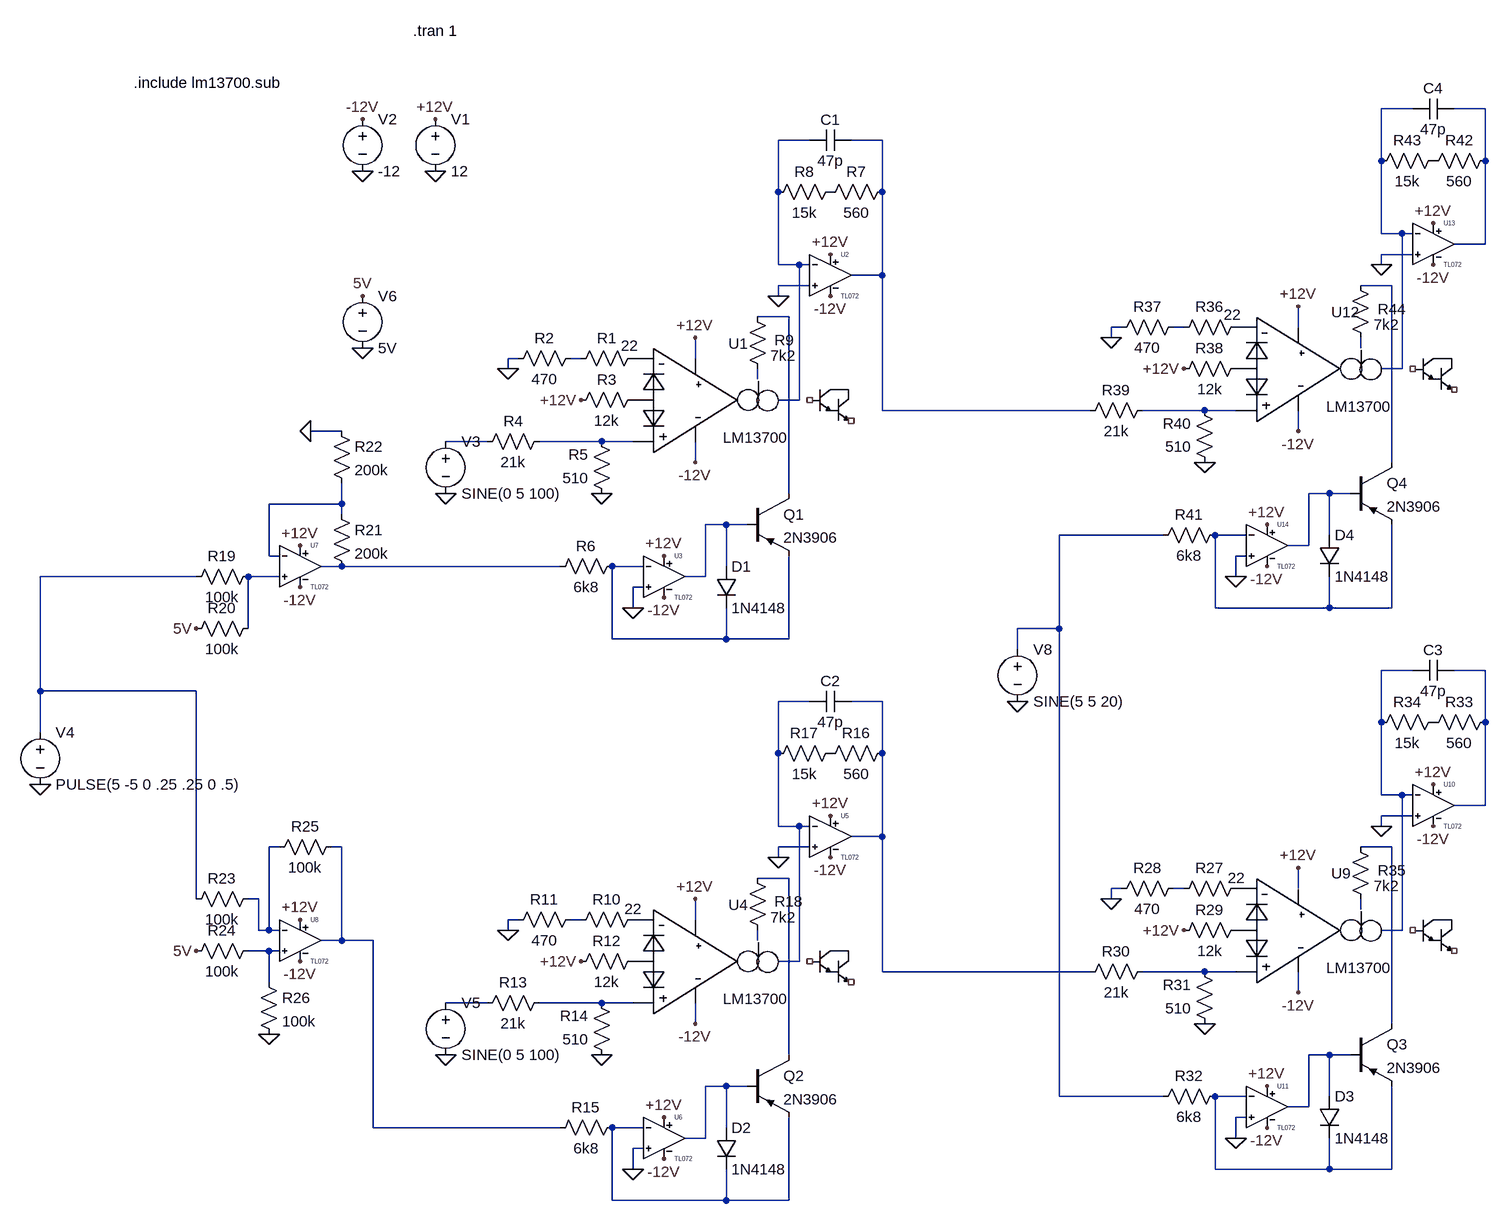
[diagram p0: schematic panner.asc]
panner.asc, the LTspice schematic file:
Version 4
SHEET 1 1512 1252
WIRE 1392 -464 1344 -464
WIRE 1504 -464 1456 -464
WIRE 464 -416 416 -416
WIRE 576 -416 528 -416
WIRE 1344 -384 1344 -464
WIRE 1504 -384 1504 -464
WIRE 416 -336 416 -416
WIRE 576 -336 576 -416
WIRE 1344 -272 1344 -384
WIRE 1376 -272 1344 -272
WIRE 1392 -272 1376 -272
WIRE 1504 -256 1504 -384
WIRE 1504 -256 1456 -256
WIRE 1392 -240 1344 -240
WIRE 416 -224 416 -336
WIRE 448 -224 416 -224
WIRE 464 -224 448 -224
WIRE 1344 -224 1344 -240
WIRE 576 -208 576 -336
WIRE 576 -208 528 -208
WIRE 464 -192 416 -192
WIRE 1360 -192 1312 -192
WIRE 416 -176 416 -192
WIRE 432 -144 384 -144
WIRE 944 -128 928 -128
WIRE 1040 -128 1024 -128
WIRE 1216 -128 1216 -160
WIRE 928 -112 928 -128
WIRE 1312 -96 1312 -112
WIRE 16 -80 0 -80
WIRE 112 -80 96 -80
WIRE 288 -80 288 -112
WIRE 0 -64 0 -80
WIRE 1376 -64 1376 -272
WIRE 1376 -64 1344 -64
WIRE 384 -48 384 -64
WIRE 448 -16 448 -224
WIRE 448 -16 416 -16
WIRE 576 0 576 -208
WIRE 896 0 576 0
WIRE 1072 0 976 0
WIRE 1120 0 1072 0
WIRE -256 32 -304 32
WIRE 1216 32 1216 0
WIRE -32 48 -96 48
WIRE 144 48 48 48
WIRE 192 48 144 48
WIRE 288 80 288 48
WIRE 1360 80 1360 -192
WIRE 432 128 432 -144
WIRE 1264 128 1232 128
WIRE 1296 128 1264 128
WIRE -256 144 -256 112
WIRE -256 144 -368 144
WIRE -256 160 -256 144
WIRE 336 176 304 176
WIRE 368 176 336 176
WIRE 1008 192 848 192
WIRE 1136 192 1088 192
WIRE 1264 192 1264 128
WIRE 1232 208 1232 128
WIRE 1232 208 1200 208
WIRE -368 224 -368 144
WIRE -352 224 -368 224
WIRE 1136 224 1120 224
WIRE -256 240 -288 240
WIRE 80 240 -256 240
WIRE 208 240 160 240
WIRE 336 240 336 176
WIRE -480 256 -720 256
WIRE -352 256 -400 256
WIRE 304 256 304 176
WIRE 304 256 272 256
WIRE 1120 256 1120 224
WIRE 208 272 192 272
WIRE 192 304 192 272
WIRE 1088 304 1088 192
WIRE 1264 304 1264 256
WIRE 1264 304 1088 304
WIRE 1360 304 1360 176
WIRE 1360 304 1264 304
WIRE -400 336 -400 256
WIRE 848 336 848 192
WIRE 848 336 784 336
WIRE 160 352 160 240
WIRE 336 352 336 304
WIRE 336 352 160 352
WIRE 432 352 432 224
WIRE 432 352 336 352
WIRE 784 368 784 336
WIRE 1392 400 1344 400
WIRE 1504 400 1456 400
WIRE -720 432 -720 256
WIRE -480 432 -720 432
WIRE 464 448 416 448
WIRE 576 448 528 448
WIRE 1344 480 1344 400
WIRE 1504 480 1504 400
WIRE -720 496 -720 432
WIRE 416 528 416 448
WIRE 576 528 576 448
WIRE 1344 592 1344 480
WIRE 1376 592 1344 592
WIRE 1392 592 1376 592
WIRE 1504 608 1504 480
WIRE 1504 608 1456 608
WIRE 1392 624 1344 624
WIRE 416 640 416 528
WIRE 448 640 416 640
WIRE 464 640 448 640
WIRE 1344 640 1344 624
WIRE 576 656 576 528
WIRE 576 656 528 656
WIRE -352 672 -368 672
WIRE -256 672 -272 672
WIRE 464 672 416 672
WIRE 1360 672 1312 672
WIRE 416 688 416 672
WIRE 432 720 384 720
WIRE 944 736 928 736
WIRE 1040 736 1024 736
WIRE 1216 736 1216 704
WIRE -480 752 -480 432
WIRE -384 752 -400 752
WIRE 928 752 928 736
WIRE 1312 768 1312 752
WIRE 16 784 0 784
WIRE 112 784 96 784
WIRE 288 784 288 752
WIRE -384 800 -384 752
WIRE -368 800 -368 672
WIRE -368 800 -384 800
WIRE -352 800 -368 800
WIRE 0 800 0 784
WIRE 1376 800 1376 592
WIRE 1376 800 1344 800
WIRE -256 816 -256 672
WIRE -256 816 -288 816
WIRE -208 816 -256 816
WIRE 384 816 384 800
WIRE -368 832 -400 832
WIRE -352 832 -368 832
WIRE 448 848 448 640
WIRE 448 848 416 848
WIRE 576 864 576 656
WIRE 896 864 576 864
WIRE 1072 864 976 864
WIRE 1120 864 1072 864
WIRE -368 880 -368 832
WIRE 1216 896 1216 864
WIRE -32 912 -96 912
WIRE 144 912 48 912
WIRE 192 912 144 912
WIRE 288 944 288 912
WIRE 1360 944 1360 672
WIRE 432 992 432 720
WIRE 1264 992 1232 992
WIRE 1296 992 1264 992
WIRE 336 1040 304 1040
WIRE 368 1040 336 1040
WIRE 848 1056 848 336
WIRE 1008 1056 848 1056
WIRE 1136 1056 1088 1056
WIRE 1264 1056 1264 992
WIRE 1232 1072 1232 992
WIRE 1232 1072 1200 1072
WIRE 1136 1088 1120 1088
WIRE -208 1104 -208 816
WIRE 80 1104 -208 1104
WIRE 208 1104 160 1104
WIRE 336 1104 336 1040
WIRE 304 1120 304 1040
WIRE 304 1120 272 1120
WIRE 1120 1120 1120 1088
WIRE 208 1136 192 1136
WIRE 192 1168 192 1136
WIRE 1088 1168 1088 1056
WIRE 1264 1168 1264 1120
WIRE 1264 1168 1088 1168
WIRE 1360 1168 1360 1040
WIRE 1360 1168 1264 1168
WIRE 160 1216 160 1104
WIRE 336 1216 336 1168
WIRE 336 1216 160 1216
WIRE 432 1216 432 1088
WIRE 432 1216 336 1216
FLAG -112 -368 0
FLAG -112 -448 +12V
FLAG -224 -448 -12V
FLAG -224 -368 0
FLAG 0 800 0
FLAG 112 848 +12V
FLAG 288 752 +12V
FLAG 496 624 +12V
FLAG 240 1088 +12V
FLAG 288 944 -12V
FLAG 496 688 -12V
FLAG 240 1152 -12V
FLAG -96 992 0
FLAG 144 992 0
FLAG 192 1168 0
FLAG 416 688 0
FLAG 0 -64 0
FLAG 112 -16 +12V
FLAG 288 -112 +12V
FLAG 496 -240 +12V
FLAG 240 224 +12V
FLAG 288 80 -12V
FLAG 496 -176 -12V
FLAG 240 288 -12V
FLAG -96 128 0
FLAG 144 128 0
FLAG 192 304 0
FLAG -720 576 0
FLAG 416 -176 0
FLAG -320 208 +12V
FLAG -320 272 -12V
FLAG -304 32 0
FLAG -224 -96 0
FLAG -224 -176 5V
FLAG -480 336 5V
FLAG -320 784 +12V
FLAG -320 848 -12V
FLAG -368 960 0
FLAG -480 832 5V
FLAG 928 752 0
FLAG 1040 800 +12V
FLAG 1216 704 +12V
FLAG 1424 576 +12V
FLAG 1168 1040 +12V
FLAG 1216 896 -12V
FLAG 1424 640 -12V
FLAG 1168 1104 -12V
FLAG 1072 944 0
FLAG 1120 1120 0
FLAG 1344 640 0
FLAG 928 -112 0
FLAG 1040 -64 +12V
FLAG 1216 -160 +12V
FLAG 1424 -288 +12V
FLAG 1168 176 +12V
FLAG 1216 32 -12V
FLAG 1424 -224 -12V
FLAG 1168 240 -12V
FLAG 1072 80 0
FLAG 1120 256 0
FLAG 1344 -224 0
FLAG 784 448 0
SYMBOL voltage -112 -464 R0
WINDOW 123 0 0 Left 0
WINDOW 39 0 0 Left 0
SYMATTR InstName V1
SYMATTR Value 12
SYMBOL voltage -224 -464 R0
WINDOW 123 0 0 Left 0
WINDOW 39 0 0 Left 0
SYMATTR InstName V2
SYMATTR Value -12
SYMBOL LM13700 256 768 R0
SYMATTR InstName U4
SYMBOL res 208 768 R90
WINDOW 0 0 56 VBottom 2
WINDOW 3 -16 15 VTop 2
SYMATTR InstName R10
SYMATTR Value 22
SYMBOL res 112 768 R90
WINDOW 0 0 56 VBottom 2
WINDOW 3 32 56 VTop 2
SYMATTR InstName R11
SYMATTR Value 470
SYMBOL res 208 832 R90
WINDOW 0 0 56 VBottom 2
WINDOW 3 32 56 VTop 2
SYMATTR InstName R12
SYMATTR Value 12k
SYMBOL voltage -96 896 R0
WINDOW 123 0 0 Left 0
WINDOW 39 0 0 Left 0
SYMATTR InstName V5
SYMATTR Value SINE(0 5 100)
SYMBOL res 64 896 R90
WINDOW 0 0 56 VBottom 2
WINDOW 3 32 56 VTop 2
SYMATTR InstName R13
SYMATTR Value 21k
SYMBOL res 160 1008 R180
WINDOW 0 36 76 Left 2
WINDOW 3 36 40 Left 2
SYMATTR InstName R14
SYMATTR Value 510
SYMBOL TL072 496 592 R0
SYMATTR InstName U5
SYMBOL TL072 240 1056 R0
SYMATTR InstName U6
SYMBOL res 176 1088 R90
WINDOW 0 0 56 VBottom 2
WINDOW 3 32 56 VTop 2
SYMATTR InstName R15
SYMATTR Value 6k8
SYMBOL res 592 512 R90
WINDOW 0 0 56 VBottom 2
WINDOW 3 32 56 VTop 2
SYMATTR InstName R16
SYMATTR Value 560
SYMBOL res 512 512 R90
WINDOW 0 0 56 VBottom 2
WINDOW 3 32 56 VTop 2
SYMATTR InstName R17
SYMATTR Value 15k
SYMBOL res 368 704 R0
WINDOW 0 42 52 Left 2
SYMATTR InstName R18
SYMATTR Value 7k2
SYMBOL pnp 368 992 R0
SYMATTR InstName Q2
SYMATTR Value 2N3906
SYMBOL diode 320 1104 R0
SYMATTR InstName D2
SYMATTR Value 1N4148
SYMBOL cap 528 432 R90
WINDOW 0 0 32 VBottom 2
WINDOW 3 32 32 VTop 2
SYMATTR InstName C2
SYMATTR Value 47p
SYMBOL LM13700 256 -96 R0
SYMATTR InstName U1
SYMBOL res 208 -96 R90
WINDOW 0 0 56 VBottom 2
WINDOW 3 -19 21 VTop 2
SYMATTR InstName R1
SYMATTR Value 22
SYMBOL res 112 -96 R90
WINDOW 0 0 56 VBottom 2
WINDOW 3 32 56 VTop 2
SYMATTR InstName R2
SYMATTR Value 470
SYMBOL res 208 -32 R90
WINDOW 0 0 56 VBottom 2
WINDOW 3 32 56 VTop 2
SYMATTR InstName R3
SYMATTR Value 12k
SYMBOL voltage -96 32 R0
WINDOW 123 0 0 Left 0
WINDOW 39 0 0 Left 0
SYMATTR InstName V3
SYMATTR Value SINE(0 5 100)
SYMBOL res 64 32 R90
WINDOW 0 0 56 VBottom 2
WINDOW 3 32 56 VTop 2
SYMATTR InstName R4
SYMATTR Value 21k
SYMBOL res 160 144 R180
WINDOW 0 36 76 Left 2
WINDOW 3 36 40 Left 2
SYMATTR InstName R5
SYMATTR Value 510
SYMBOL TL072 496 -272 R0
SYMATTR InstName U2
SYMBOL TL072 240 192 R0
SYMATTR InstName U3
SYMBOL res 176 224 R90
WINDOW 0 0 56 VBottom 2
WINDOW 3 32 56 VTop 2
SYMATTR InstName R6
SYMATTR Value 6k8
SYMBOL res 592 -352 R90
WINDOW 0 0 56 VBottom 2
WINDOW 3 32 56 VTop 2
SYMATTR InstName R7
SYMATTR Value 560
SYMBOL res 512 -352 R90
WINDOW 0 0 56 VBottom 2
WINDOW 3 32 56 VTop 2
SYMATTR InstName R8
SYMATTR Value 15k
SYMBOL res 368 -160 R0
WINDOW 0 42 52 Left 2
SYMATTR InstName R9
SYMATTR Value 7k2
SYMBOL pnp 368 128 R0
SYMATTR InstName Q1
SYMATTR Value 2N3906
SYMBOL diode 320 240 R0
SYMATTR InstName D1
SYMATTR Value 1N4148
SYMBOL voltage -720 480 R0
WINDOW 123 0 0 Left 0
WINDOW 39 0 0 Left 0
SYMATTR InstName V4
SYMATTR Value PULSE(5 -5 0 .25 .25 0 .5)
SYMBOL cap 528 -432 R90
WINDOW 0 0 32 VBottom 2
WINDOW 3 32 32 VTop 2
SYMATTR InstName C1
SYMATTR Value 47p
SYMBOL TL072 -320 176 R0
SYMATTR InstName U7
SYMBOL res -384 240 R90
WINDOW 0 0 56 VBottom 2
WINDOW 3 32 56 VTop 2
SYMATTR InstName R19
SYMATTR Value 100k
SYMBOL res -384 320 R90
WINDOW 0 0 56 VBottom 2
WINDOW 3 32 56 VTop 2
SYMATTR InstName R20
SYMATTR Value 100k
SYMBOL res -272 144 R0
SYMATTR InstName R21
SYMATTR Value 200k
SYMBOL res -272 16 R0
SYMATTR InstName R22
SYMATTR Value 200k
SYMBOL voltage -224 -192 R0
WINDOW 123 0 0 Left 0
WINDOW 39 0 0 Left 0
SYMATTR InstName V6
SYMATTR Value 5V
SYMBOL TL072 -320 752 R0
SYMATTR InstName U8
SYMBOL res -384 736 R90
WINDOW 0 0 56 VBottom 2
WINDOW 3 32 56 VTop 2
SYMATTR InstName R23
SYMATTR Value 100k
SYMBOL res -384 816 R90
WINDOW 0 0 56 VBottom 2
WINDOW 3 32 56 VTop 2
SYMATTR InstName R24
SYMATTR Value 100k
SYMBOL res -256 656 R90
WINDOW 0 0 56 VBottom 2
WINDOW 3 32 56 VTop 2
SYMATTR InstName R25
SYMATTR Value 100k
SYMBOL res -384 864 R0
SYMATTR InstName R26
SYMATTR Value 100k
SYMBOL LM13700 1184 720 R0
SYMATTR InstName U9
SYMBOL res 1136 720 R90
WINDOW 0 0 56 VBottom 2
WINDOW 3 -16 15 VTop 2
SYMATTR InstName R27
SYMATTR Value 22
SYMBOL res 1040 720 R90
WINDOW 0 0 56 VBottom 2
WINDOW 3 32 56 VTop 2
SYMATTR InstName R28
SYMATTR Value 470
SYMBOL res 1136 784 R90
WINDOW 0 0 56 VBottom 2
WINDOW 3 32 56 VTop 2
SYMATTR InstName R29
SYMATTR Value 12k
SYMBOL res 992 848 R90
WINDOW 0 0 56 VBottom 2
WINDOW 3 32 56 VTop 2
SYMATTR InstName R30
SYMATTR Value 21k
SYMBOL res 1088 960 R180
WINDOW 0 36 76 Left 2
WINDOW 3 36 40 Left 2
SYMATTR InstName R31
SYMATTR Value 510
SYMBOL TL072 1424 544 R0
SYMATTR InstName U10
SYMBOL TL072 1168 1008 R0
SYMATTR InstName U11
SYMBOL res 1104 1040 R90
WINDOW 0 0 56 VBottom 2
WINDOW 3 32 56 VTop 2
SYMATTR InstName R32
SYMATTR Value 6k8
SYMBOL res 1520 464 R90
WINDOW 0 0 56 VBottom 2
WINDOW 3 32 56 VTop 2
SYMATTR InstName R33
SYMATTR Value 560
SYMBOL res 1440 464 R90
WINDOW 0 0 56 VBottom 2
WINDOW 3 32 56 VTop 2
SYMATTR InstName R34
SYMATTR Value 15k
SYMBOL res 1296 656 R0
WINDOW 0 42 52 Left 2
SYMATTR InstName R35
SYMATTR Value 7k2
SYMBOL pnp 1296 944 R0
SYMATTR InstName Q3
SYMATTR Value 2N3906
SYMBOL diode 1248 1056 R0
SYMATTR InstName D3
SYMATTR Value 1N4148
SYMBOL cap 1456 384 R90
WINDOW 0 0 32 VBottom 2
WINDOW 3 32 32 VTop 2
SYMATTR InstName C3
SYMATTR Value 47p
SYMBOL LM13700 1184 -144 R0
SYMATTR InstName U12
SYMBOL res 1136 -144 R90
WINDOW 0 0 56 VBottom 2
WINDOW 3 -19 21 VTop 2
SYMATTR InstName R36
SYMATTR Value 22
SYMBOL res 1040 -144 R90
WINDOW 0 0 56 VBottom 2
WINDOW 3 32 56 VTop 2
SYMATTR InstName R37
SYMATTR Value 470
SYMBOL res 1136 -80 R90
WINDOW 0 0 56 VBottom 2
WINDOW 3 32 56 VTop 2
SYMATTR InstName R38
SYMATTR Value 12k
SYMBOL res 992 -16 R90
WINDOW 0 0 56 VBottom 2
WINDOW 3 32 56 VTop 2
SYMATTR InstName R39
SYMATTR Value 21k
SYMBOL res 1088 96 R180
WINDOW 0 36 76 Left 2
WINDOW 3 36 40 Left 2
SYMATTR InstName R40
SYMATTR Value 510
SYMBOL TL072 1424 -320 R0
SYMATTR InstName U13
SYMBOL TL072 1168 144 R0
SYMATTR InstName U14
SYMBOL res 1104 176 R90
WINDOW 0 0 56 VBottom 2
WINDOW 3 32 56 VTop 2
SYMATTR InstName R41
SYMATTR Value 6k8
SYMBOL res 1520 -400 R90
WINDOW 0 0 56 VBottom 2
WINDOW 3 32 56 VTop 2
SYMATTR InstName R42
SYMATTR Value 560
SYMBOL res 1440 -400 R90
WINDOW 0 0 56 VBottom 2
WINDOW 3 32 56 VTop 2
SYMATTR InstName R43
SYMATTR Value 15k
SYMBOL res 1296 -208 R0
WINDOW 0 42 52 Left 2
SYMATTR InstName R44
SYMATTR Value 7k2
SYMBOL pnp 1296 80 R0
SYMATTR InstName Q4
SYMATTR Value 2N3906
SYMBOL diode 1248 192 R0
SYMATTR InstName D4
SYMATTR Value 1N4148
SYMBOL cap 1456 -480 R90
WINDOW 0 0 32 VBottom 2
WINDOW 3 32 32 VTop 2
SYMATTR InstName C4
SYMATTR Value 47p
SYMBOL voltage 784 352 R0
WINDOW 123 0 0 Left 0
WINDOW 39 0 0 Left 0
SYMATTR InstName V8
SYMATTR Value SINE(5 5 20)
TEXT -146 -584 Left 2 !.tran 1
TEXT -576 -504 Left 2 !.include lm13700.sub

The netlist it stands for:
* panner.asc
V1 +12V 0 12
V2 -12V 0 -12
XU4 P001 N038 P002 N034 N025 +12V -12V NC_01 NC_02 LM13700 HALF13700  ; pins LIN INP INN IAB ? VCC VSS BIN BUF
R10 P002 N033 22
R11 N033 0 470
R12 P001 +12V 12k
V5 N037 0 SINE(0 5 100)
R13 N038 N037 21k
R14 0 N038 510
XU5 0 N025 +12V -12V N026 TL072  ; pins In+ In- V+ V- OUT
XU6 0 N042 +12V -12V N040 TL072  ; pins In+ In- V+ V- OUT
R15 N042 N028 6k8
R16 N026 P003 560
R17 P003 N025 15k
R18 N030 N034 7k2
Q2 N030 N040 N042 0 2N3906
D2 N040 N042 1N4148
C2 N026 N025 47p
XU1 P004 N013 P005 N010 N003 +12V -12V NC_03 NC_04 LM13700 HALF13700  ; pins LIN INP INN IAB ? VCC VSS BIN BUF
R1 P005 N009 22
R2 N009 0 470
R3 P004 +12V 12k
V3 N012 0 SINE(0 5 100)
R4 N013 N012 21k
R5 0 N013 510
XU2 0 N003 +12V -12V N004 TL072  ; pins In+ In- V+ V- OUT
XU3 0 N020 +12V -12V N016 TL072  ; pins In+ In- V+ V- OUT
R6 N020 N019 6k8
R7 N004 P006 560
R8 P006 N003 15k
R9 N006 N010 7k2
Q1 N006 N016 N020 0 2N3906
D1 N016 N020 1N4148
V4 N021 0 PULSE(5 -5 0 .25 .25 0 .5)
C1 N004 N003 47p
XU7 N022 N015 +12V -12V N019 TL072  ; pins In+ In- V+ V- OUT
R19 N022 N021 100k
R20 N022 5V 100k
R21 N015 N019 200k
R22 0 N015 200k
V6 5V 0 5V
XU8 N035 N027 +12V -12V N028 TL072  ; pins In+ In- V+ V- OUT
R23 N027 N021 100k
R24 N035 5V 100k
R25 N028 N027 100k
R26 N035 0 100k
XU9 P007 N036 P008 N032 N023 +12V -12V NC_05 NC_06 LM13700 HALF13700  ; pins LIN INP INN IAB ? VCC VSS BIN BUF
R27 P008 N031 22
R28 N031 0 470
R29 P007 +12V 12k
R30 N036 N026 21k
R31 0 N036 510
XU10 0 N023 +12V -12V N024 TL072  ; pins In+ In- V+ V- OUT
XU11 0 N041 +12V -12V N039 TL072  ; pins In+ In- V+ V- OUT
R32 N041 N017 6k8
R33 N024 P009 560
R34 P009 N023 15k
R35 N029 N032 7k2
Q3 N029 N039 N041 0 2N3906
D3 N039 N041 1N4148
C3 N024 N023 47p
XU12 P010 N011 P011 N008 N001 +12V -12V NC_07 NC_08 LM13700 HALF13700  ; pins LIN INP INN IAB ? VCC VSS BIN BUF
R36 P011 N007 22
R37 N007 0 470
R38 P010 +12V 12k
R39 N011 N004 21k
R40 0 N011 510
XU13 0 N001 +12V -12V N002 TL072  ; pins In+ In- V+ V- OUT
XU14 0 N018 +12V -12V N014 TL072  ; pins In+ In- V+ V- OUT
R41 N018 N017 6k8
R42 N002 P012 560
R43 P012 N001 15k
R44 N005 N008 7k2
Q4 N005 N014 N018 0 2N3906
D4 N014 N018 1N4148
C4 N002 N001 47p
V8 N017 0 SINE(5 5 20)
.model D D
.lib standard.dio
.model NPN NPN
.model PNP PNP
.lib standard.bjt
.tran 1
.include lm13700.sub
.lib TL072.sub
.backanno
.end